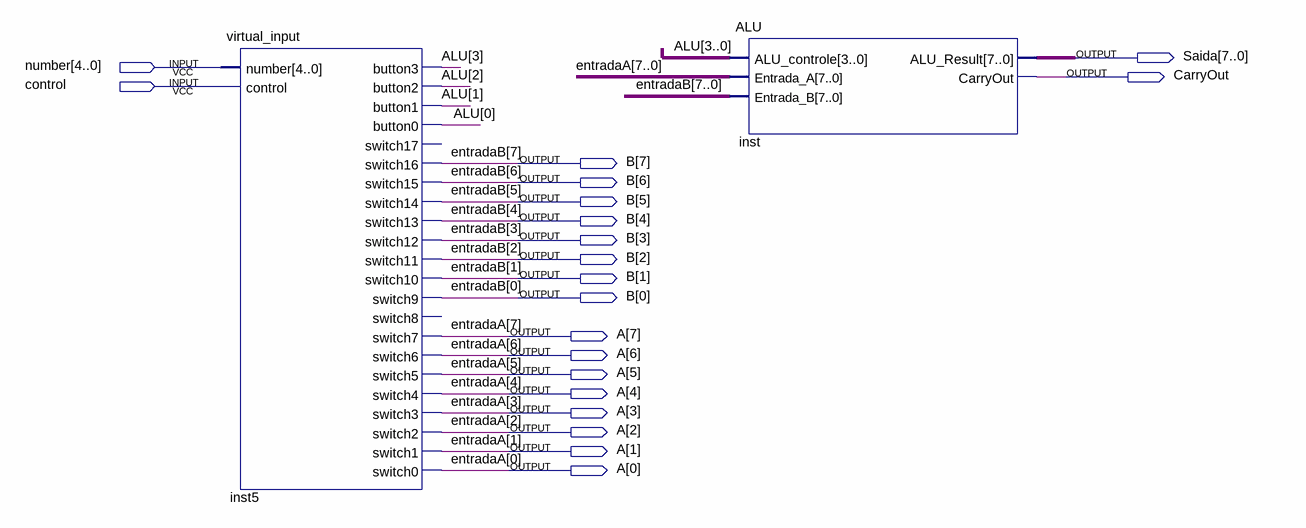
[diagram p0: schematic sheet]
// Quartus schematic toplevel.bdf as structural Verilog: 2 symbols, 20 pins
module toplevel (
  input  [4:0] number,
  input  control,
  output [7:0] Saida,
  output CarryOut,
  output [7:0] B,
  output [7:0] A
);

  wire [3:0] ALU;

  virtual_input inst5 (
    .number(number), .control(control), .button3(ALU[3]), .button2(ALU[2]), .button1(ALU[1]),
    .button0(ALU[0]), .switch16(B[7]), .switch15(B[6]), .switch14(B[5]), .switch13(B[4]), .switch12(B[3]),
    .switch11(B[2]), .switch10(B[1]), .switch9(B[0]), .switch7(A[7]), .switch6(A[6]), .switch5(A[5]),
    .switch4(A[4]), .switch3(A[3]), .switch2(A[2]), .switch1(A[1]), .switch0(A[0]));  // open: switch17, switch8
  ALU inst (.ALU_controle(ALU), .Entrada_A(A), .Entrada_B(B), .ALU_Result(Saida), .CarryOut(CarryOut));

  // Other names for the same wires on the sheet: entradaA[7:0] = A; entradaB[7:0] = B
endmodule
